# EAGLE design base-2u-psu-adapter (EAGLE 6.2)
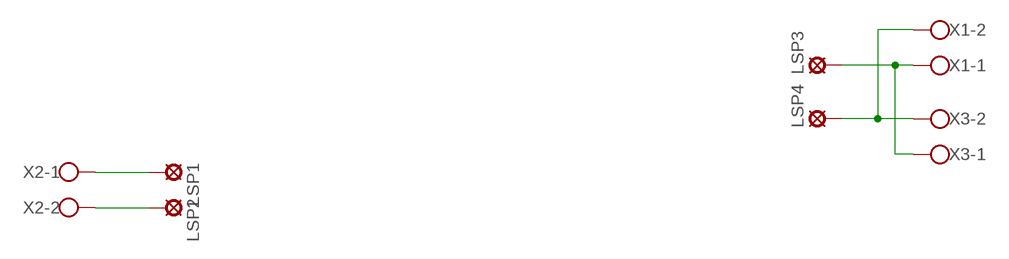
[diagram p0: schematic, sheet 1]

## Parts
LSP1  LSP10  [LSP10]
LSP2  LSP10  [LSP10]
LSP3  LSP10  [LSP10]
LSP4  LSP10  [LSP10]
X1  W237-102  [W237-102]
X2  W237-102  [W237-102]
X3  W237-102  [W237-102]

## Nets
GND: LSP4.MP X1.2 X3.2
N: LSP2.MP X2.2
N$1: LSP3.MP X1.1 X3.1
N$3: LSP1.MP X2.1

## Library data of the parts
LSP1-LSP4 = solpad:LSP10: SOLDER PAD drill 1.0 mm, distributor Buerklin, 12H555
X1-X3 = con-wago-500:W237-102: WAGO SCREW CLAMP

## Board
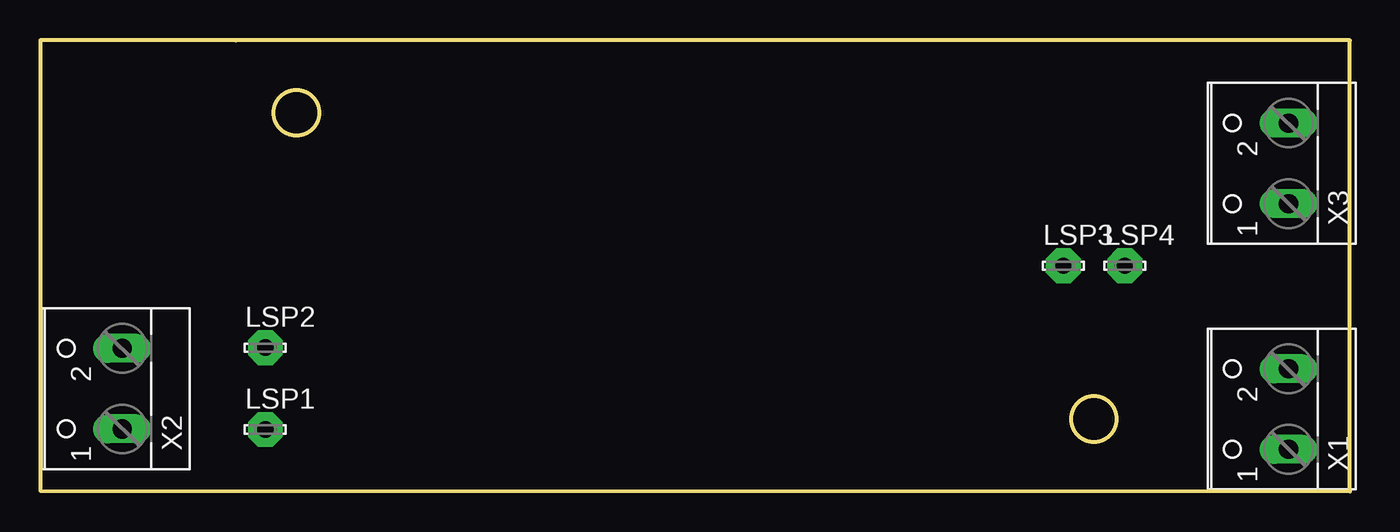
[diagram p1: board, top side]
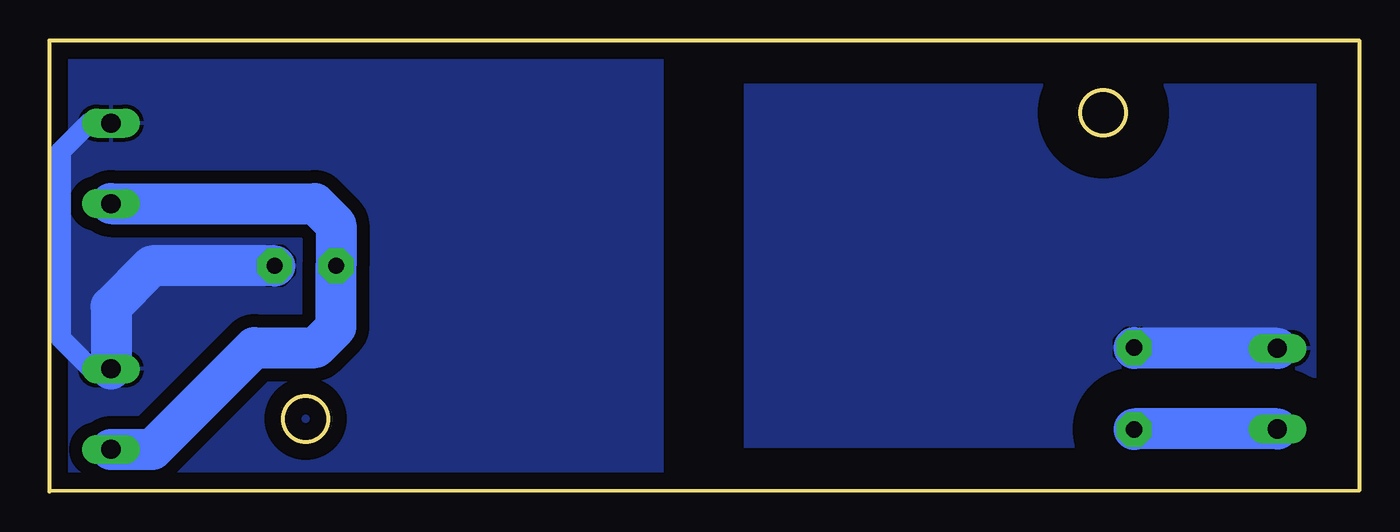
[diagram p2: board, bottom side, seen from below]

Size 81.28 x 27.98 mm. Coordinates in mm from the lower left corner, seen from the top.
Outline: 81.28,27.98 12.14,27.98 0,27.98 0,0.04 81.28,0 81.28,27.98
Outline: circle at 15.89,23.49 radius 1.4
Outline: circle at 65.39,4.49 radius 1.4
Copper layers (1*16): Top 0.035mm / dielectric 1.5mm / Bottom 0.035mm
Design rules: minimum track width 10mil, minimum drill 24mil, track to track 8mil, track to pad 8mil, pad to pad 8mil, via to via 8mil, smd to smd 8mil, copper to edge 40mil, drill to drill 8mil, minimum pad ring 10mil, minimum via ring 8mil, stop-mask expansion 4mil, vias tented up to drill 0mil, thermal gap 10mil

### Footprints (pad centres in the part's own frame; a part is rotated, then mirrored left to right if it is on the bottom)
LSP10 = drill 1.016 pad 2.159 octagon: MP 0,0
W237-102 = drill 1.194 long: 1 -2.5,-1.27; 2 2.5,-1.27

### Placement (x,y rotation side)
LSP1  13.97,3.83 0 top
LSP2  13.97,8.91 0 top
LSP3  63.5,13.99 0 top
LSP4  67.31,13.99 0 top
X1  76.2,5.1 90 top
X2  3.81,6.37 90 top
X3  76.2,20.34 90 top

### Tracks (layer width: path | path; a pad name or v marks a point on that pad's centre or on a via)
GND
  Bottom 1.27: X3.2 78.86,22.84 80.59,21.11 80.59,9.49 78.74,7.64 77.51,7.64 X1.2
  Bottom 2.54: LSP4.MP 74.93,13.99 77.47,11.45 X1.2
  pour Bottom (isolate 0.813): 43.18,27.96 81.28,27.96 81.28,0.02 43.18,0.02
N
  Bottom 2.54: X2.2 13.97,8.87 LSP2.MP
  pour Bottom (isolate 2.54): 0,27.96 38.1,27.96 38.1,0.02 0,0.02
N$1
  Bottom 2.54: X1.1 74.89,2.6 68.58,8.91 64.77,8.91 63.5,10.18 LSP3.MP 63.5,16.53 64.81,17.84 X3.1
N$3
  Bottom 2.54: X2.1 13.97,3.87 LSP1.MP

### Text on the board
Measures: 24.74 | 15.24 | 5.74 | 15.89 | 40.64 | 65.39